# EasyEDA schematic uOhm_Schematic.json
TITLE: Sheet_1; REV: 1.0; Date: 2022-03-04; Sheet: 1/1; Drawn By: Tirth Patel; Company: Your Company
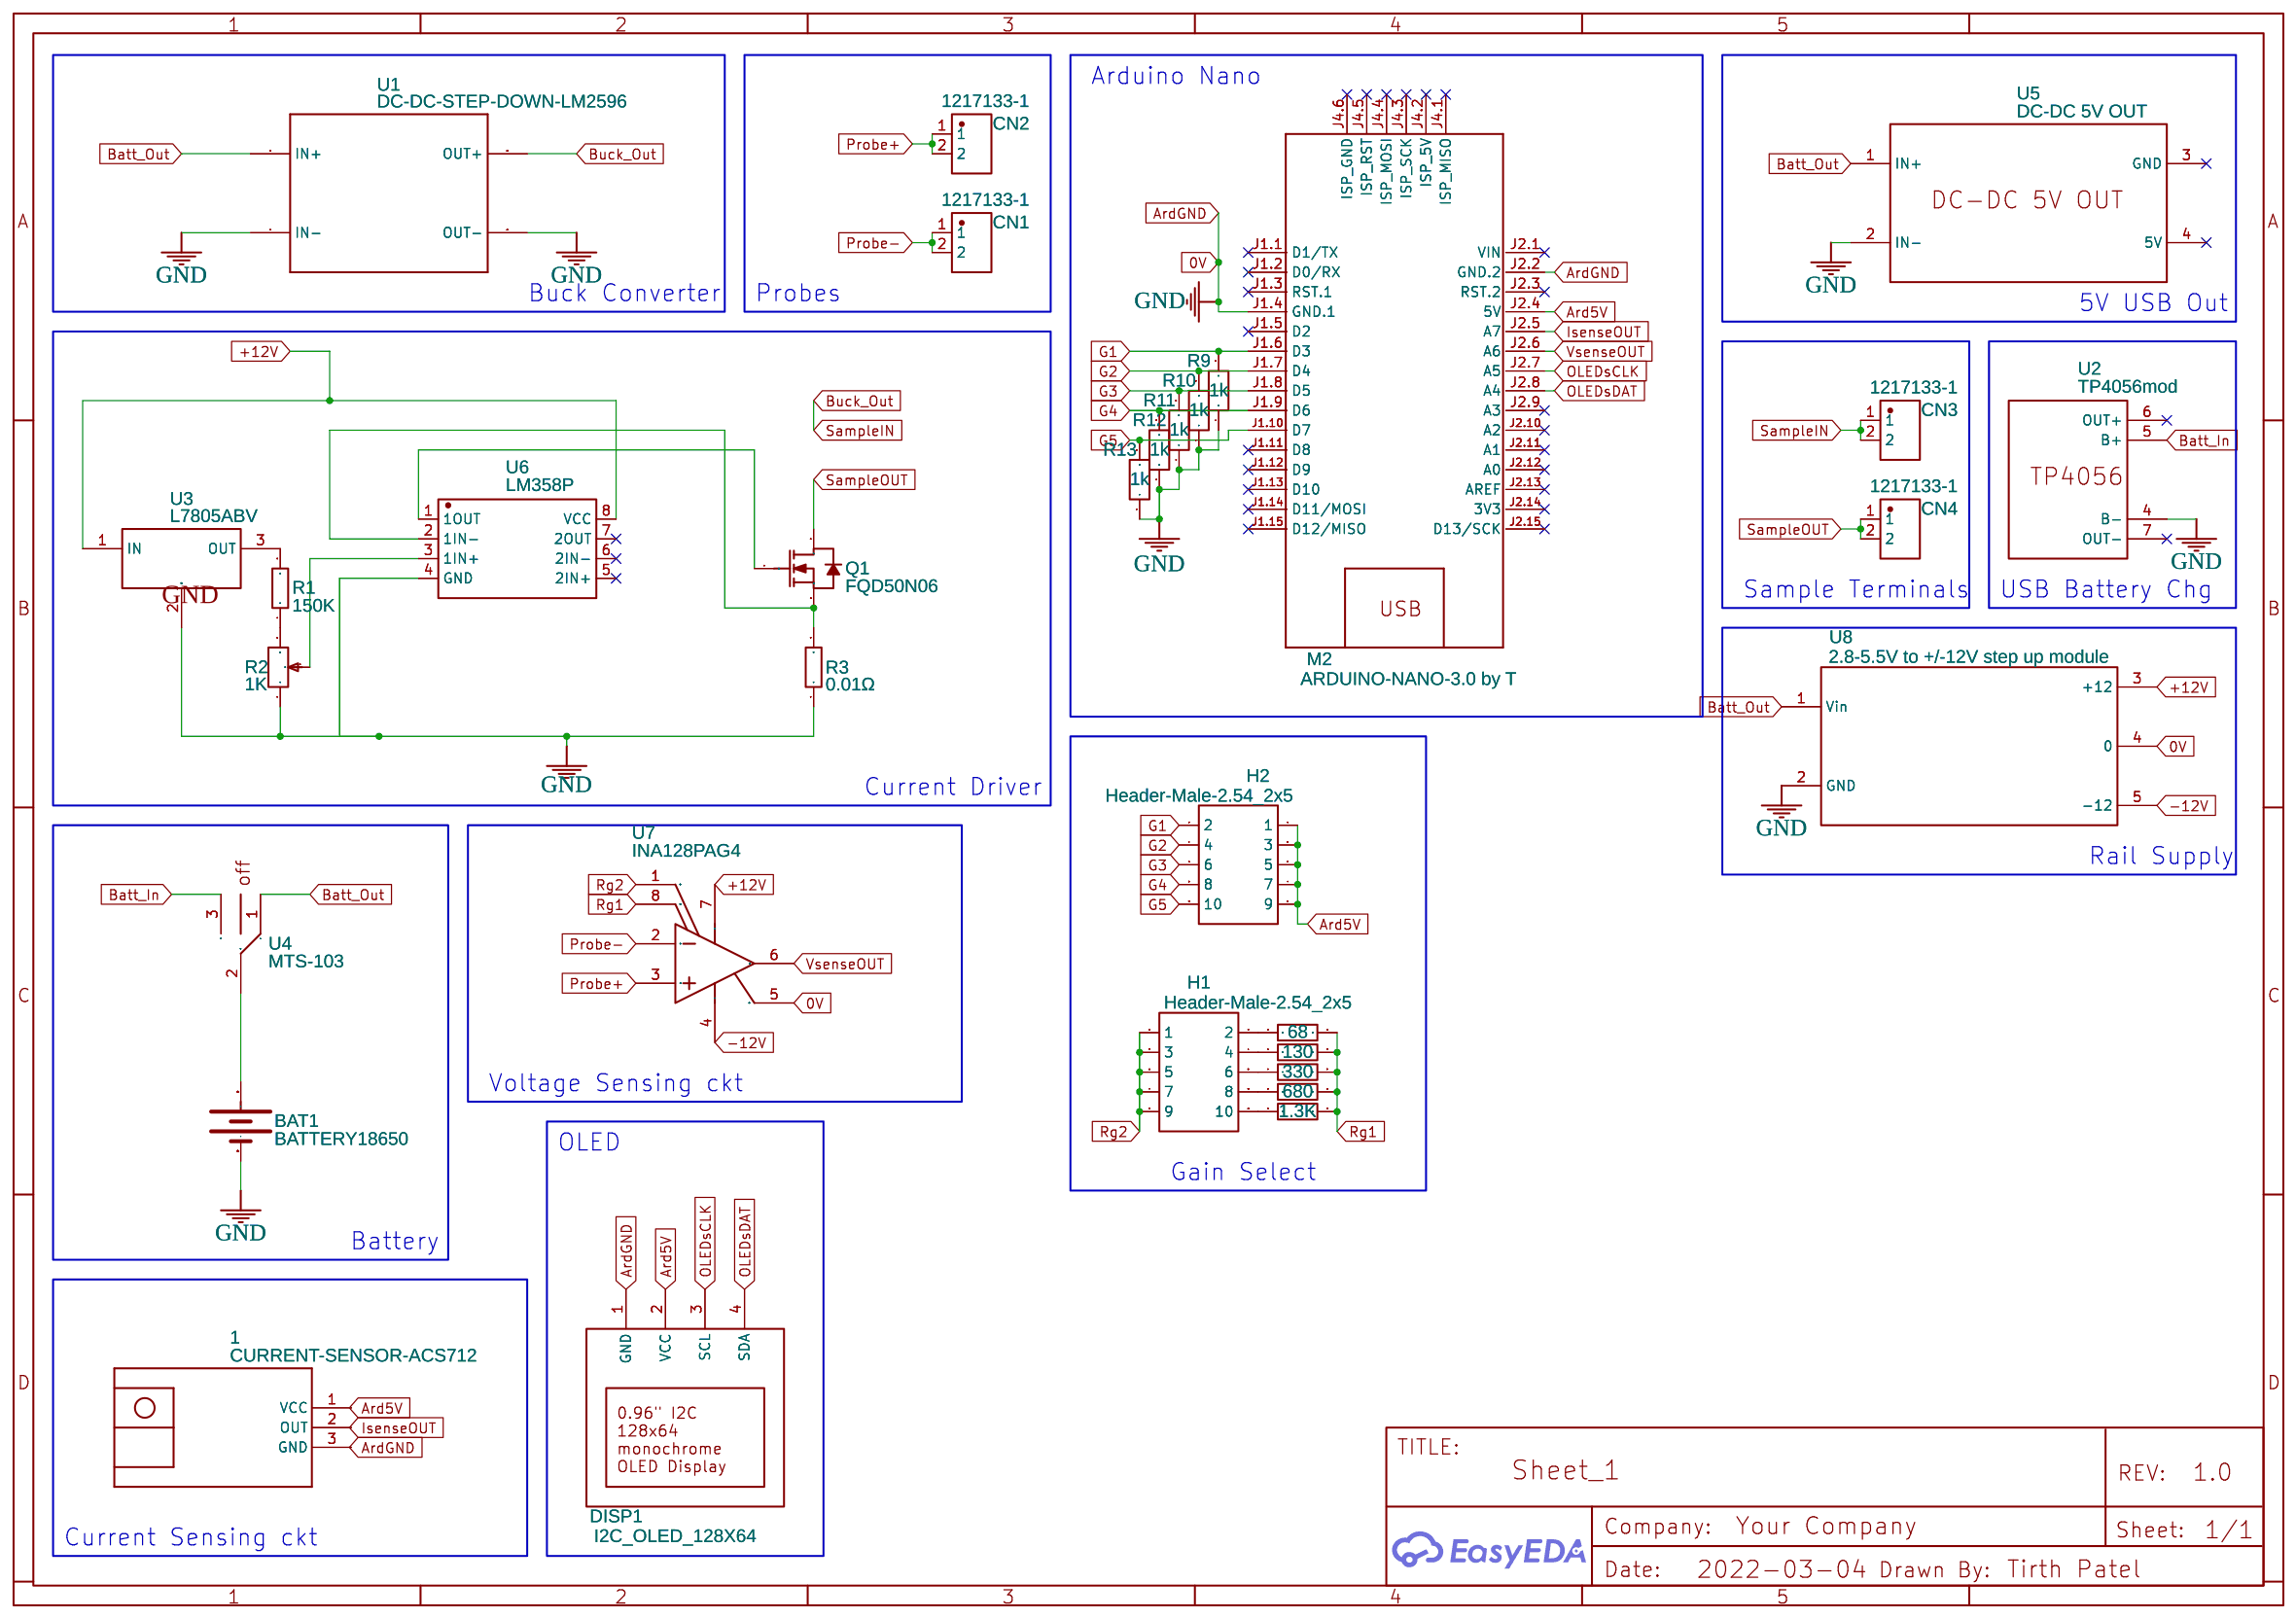
[diagram p0: schematic sheet]

## Parts
1  CURRENT-SENSOR-ACS712  [CURRENT-SENSOR-ACS712]
BAT1  BATTERY18650  [BATTERY_18650-HOLDER]
CN1  1217133-1  [CONN-TH_2P-L7.5-W3.1-P5.08_1217133-1]
CN2  1217133-1  [CONN-TH_2P-L7.5-W3.1-P5.08_1217133-1]
CN3  1217133-1  [CONN-TH_2P-L7.5-W3.1-P5.08_1217133-1]
CN4  1217133-1  [CONN-TH_2P-L7.5-W3.1-P5.08_1217133-1]
DISP1  I2C_OLED_128X64  [OLED12864_096I2C]
H1  Header-Male-2.54_2x5  [HDR-TH_10P-P2.54-V-M-R2-C5-S2.54]
H2  Header-Male-2.54_2x5  [HDR-TH_10P-P2.54-V-M-R2-C5-S2.54]
M2  ARDUINO-NANO-3.0 by T  [ARDUINO-NANO-3.0#ISP]
Q1  FQD50N06  [TO-252-3_L6.5-W5.8-P4.58-BR]
R1  150K  [RES-TH_BD2.5-L6.5-P10.50-D0.6]
R2  1K  [RES-ADJ-TH_3296W]
R3  0.01Ω  [RES-SMD_L6.4-W3.2]
R4  330  [RES-TH_BD3.3-L9.0-P13.00-D0.6]
R5  130  [RES-TH_BD3.3-L9.0-P13.00-D0.6]
R6  680  [RES-TH_BD2.2-L6.5-P10.50-D0.6]
R7  68  [RES-TH_BD3.5-L9.0-P13.00-D0.8]
R8  1.3K  [RES-TH_BD2.2-L6.5-P10.50-D0.6]
R9  1k  [RES-TH_BD2.2-L6.5-P10.50-D0.9]
R10  1k  [RES-TH_BD2.2-L6.5-P10.50-D0.9]
R11  1k  [RES-TH_BD2.2-L6.5-P10.50-D0.9]
R12  1k  [RES-TH_BD2.2-L6.5-P10.50-D0.9]
R13  1k  [RES-TH_BD2.2-L6.5-P10.50-D0.9]
U1  DC-DC-STEP-DOWN-LM2596  [DC-DC-STEP-DOWN-LM2596]
U2  TP4056mod  [TP4056-PROTECT]
U3  L7805ABV  [TO-220-3_L10.0-W4.5-P2.54-L]
U4  MTS-103  [MTS-103]
U5  DC-DC 5V OUT  [DC-DC 5V OUT]
U6  LM358P  [DIP-8_L9.4-W6.4-P2.54-LS9.1-BL]
U7  INA128PAG4  [DIP-8_L9.4-W6.4-P2.54-LS9.1-BL]
U8  2.8-5.5V to +/-12V step up module  [2.8/5.5TO+/-12]

## Library data of the parts
1 = CURRENT-SENSOR-ACS712: Contributor: Dimitri Chiminello
BAT1 = BATTERY18650: Battery Holders; Contributor: SparkFun
CN1-CN4 = 1217133-1: Supplier: LCSC; Supplier Part: C133061; Manufacturer: TE Connectivity(美国泰科); Contributor: LCSC
DISP1 = I2C_OLED_128X64: Contributor: fohengineer; sourceId: hdI0icuoG
H1 H2 = Header-Male-2.54_2x5: Supplier: LCSC; Manufacturer Part: 2*5pHeaders  Pins 2.54mm; Supplier Part: C28207
M2 = ARDUINO-NANO-3.0 by T: Contributor: thien1900
Q1 = FQD50N06: Supplier: LCSC; Supplier Part: C725048; Manufacturer: VBsemi Elec; Contributor: LCSC; JLCPCB Part Class: Extended Part
R1 = MFR0W4F1503A50: Supplier: LCSC; Manufacturer: UniOhm; Supplier Part: C58618; JLCPCB Part Class: Extended Part; Resistance: 150kΩ
R2 = 3296W-1-102LF: Supplier: LCSC; Manufacturer: BOURNS; Supplier Part: C57089; JLCPCB Part Class: Extended Part
R3 = LR2512-23R010F4: Supplier: LCSC; Supplier Part: C323803; Manufacturer: RALEC; Contributor: LCSC; Resistance (Ohms): 0.01; JLCPCB Part Class: Extended Part
R4 = MFR1WSFTE52-330R: Supplier: LCSC; Supplier Part: C172941; Manufacturer: YAGEO; Contributor: LCSC; JLCPCB Part Class: Extended Part; Resistance: 330Ω
R5 = RD50T5131J: Supplier: LCSC; Supplier Part: C167536; Manufacturer: TA-I Tech; Contributor: LCSC; JLCPCB Part Class: Extended Part; Resistance: 130Ω
R6 = MFR0W4F6800A50: Supplier: LCSC; Manufacturer: UniOhm; Supplier Part: C58599; JLCPCB Part Class: Extended Part; Resistance: 680Ω
R7 = RSS02J68R0A520NH: Supplier: LCSC; Supplier Part: C274837; Manufacturer: Futaba Elec; Contributor: LCSC; JLCPCB Part Class: Extended Part; Resistance: 68Ω
R8 = CFR0W4J0132A50: Supplier: LCSC; Manufacturer: UniOhm; Supplier Part: C70828; JLCPCB Part Class: Extended Part; Resistance: 1.3kΩ
R9-R13 = CFR0W4J0102A50_C66649: Supplier: LCSC; Supplier Part: C66649; Manufacturer: Uniroyal Elec; Manufacturer Part: CFR0W4J0102A50; Contributor: LCSC; JLCPCB Part Class: Extended Part
U1 = DC-DC-STEP-DOWN-LM2596: DCDC Step-Down Regulator based on LM2596-ADJ chip
U2 = TP4056mod: Manufacturer Part: TP4056-protect; link: https://dlnmh9ip6v2uc.cloudfront.net/datasheets/Prototyping/TP4056.pdf; Contributor: williamnef
U3 = L7805ABV: Supplier: LCSC; Manufacturer: STMicroelectronics; Supplier Part: C16807; JLCPCB Part Class: Extended Part
U4 = MTS-103: link: https://www.taydaelectronics.com/mini-toggle-switch-spdt-on-off-on-mts-103-c1.html; Contributor: Tong He (ht93)
U5 = DC-DC 5V OUT: Manufacturer Part: STEP UP; Contributor: paoloferrara
U6 = LM358P: Supplier: LCSC; Manufacturer: TI; Supplier Part: C5213; JLCPCB Part Class: Extended Part
U7 = INA128PAG4: Supplier: LCSC; Manufacturer: TI; Supplier Part: C28937; JLCPCB Part Class: Extended Part
U8 = 2.8-5.5V to +/-12V step up module: Contributor: Tirth Patel

## Nets
0V: 1.3(GND) BAT1.GND@1(-) DISP1.1(GND) M2.J1.4(GND.1) M2.J2.2(GND.2) R2.1 R3.1 R9.1 R10.1 R11.1 R12.1 R13.1 U1.IN- U1.OUT- U2.4(B-) U3.2(GND) U5.2(IN-) U6.4(GND) U7.5(REF) U8.2(GND) U8.4(0)
+12V: U3.1(IN) U6.8(VCC) U7.7(V+) U8.3(+12)
-12V: U7.4(V-) U8.5(-12)
Ard5V: 1.1(VCC) DISP1.2(VCC) H2.1 H2.3 H2.5 H2.7 H2.9 M2.J2.4(5V)
Batt_In: U2.5(B+) U4.3
Batt_Out: U1.IN+ U4.1 U5.1(IN+) U8.1(Vin)
Buck_Out: CN3.1 CN3.2 U1.OUT+
G1: H2.2 M2.J1.6(D3) R9.2
G2: H2.4 M2.J1.7(D4) R10.2
G3: H2.6 M2.J1.8(D5) R11.2
G4: H2.8 M2.J1.9(D6) R12.2
G5: H2.10 M2.J1.10(D7) R13.2
IsenseOUT: 1.2(OUT) M2.J2.5(A7)
OLEDsCLK: DISP1.3(SCL) M2.J2.7(A5)
OLEDsDAT: DISP1.4(SDA) M2.J2.8(A4)
Probe+: CN2.1 CN2.2 U7.3(VIN+)
Probe-: CN1.1 CN1.2 U7.2(VIN-)
Rg1: R4.2 R5.2 R6.2 R7.2 R8.2 U7.8(RG)
Rg2: H1.1 H1.3 H1.5 H1.7 H1.9 U7.1(RG)
SampleOUT: CN4.1 CN4.2 Q1.2(D)
VsenseOUT: M2.J2.6(A6) U7.6(VO)
Net-(BAT1-PWR@1): BAT1.PWR@1(+) U4.2
Net-(H1-2): H1.2 R7.1
Net-(H1-4): H1.4 R5.1
Net-(H1-6): H1.6 R4.1
Net-(H1-8): H1.8 R6.1
Net-(H1-10): H1.10 R8.1
Net-(Q1-1): Q1.1(G) U6.1(1OUT)
Net-(Q1-3): Q1.3(S) R3.2 U6.2(1IN-)
Net-(R1-1): R1.1 R2.3
Net-(R1-2): R1.2 U3.3(OUT)
Net-(R2-2): R2.2 U6.3(1IN+)

Not connected (* = marked no-connect by the designer): M2 J1.1(D1/TX)* J1.2(D0/RX)* J1.3(RST.1)* J1.5(D2)* J1.11(D8)* J1.12(D9)* J1.13(D10)* J1.14(D11/MOSI)* J1.15(D12/MISO)* J2.1(VIN)* J2.3(RST.2)* J2.9(A3)* J2.10(A2)* J2.11(A1)* J2.12(A0)* J2.13(AREF)* J2.14(3V3)* J2.15(D13/SCK)* J4.1(ISP_MISO)* J4.2(ISP_5V)* J4.3(ISP_SCK)* J4.4(ISP_MOSI)* J4.5(ISP_RST)* J4.6(ISP_GND)*; U2 6(OUT+)* 7(OUT-)*; U5 3(GND)* 4(5V)*; U6 5(2IN+)* 6(2IN-)* 7(2OUT)*

## Notes on the sheet
- Arduino Nano
- Buck Converter
- Probes
- 5V USB Out
- Sample Terminals
- USB Battery Chg
- Current Driver
- Rail Supply
- Voltage Sensing ckt
- OLED
- Gain Select
- Battery
- Current Sensing ckt
